# EAGLE schematic lap_counter_V1.2 (EAGLE 9.6.0)
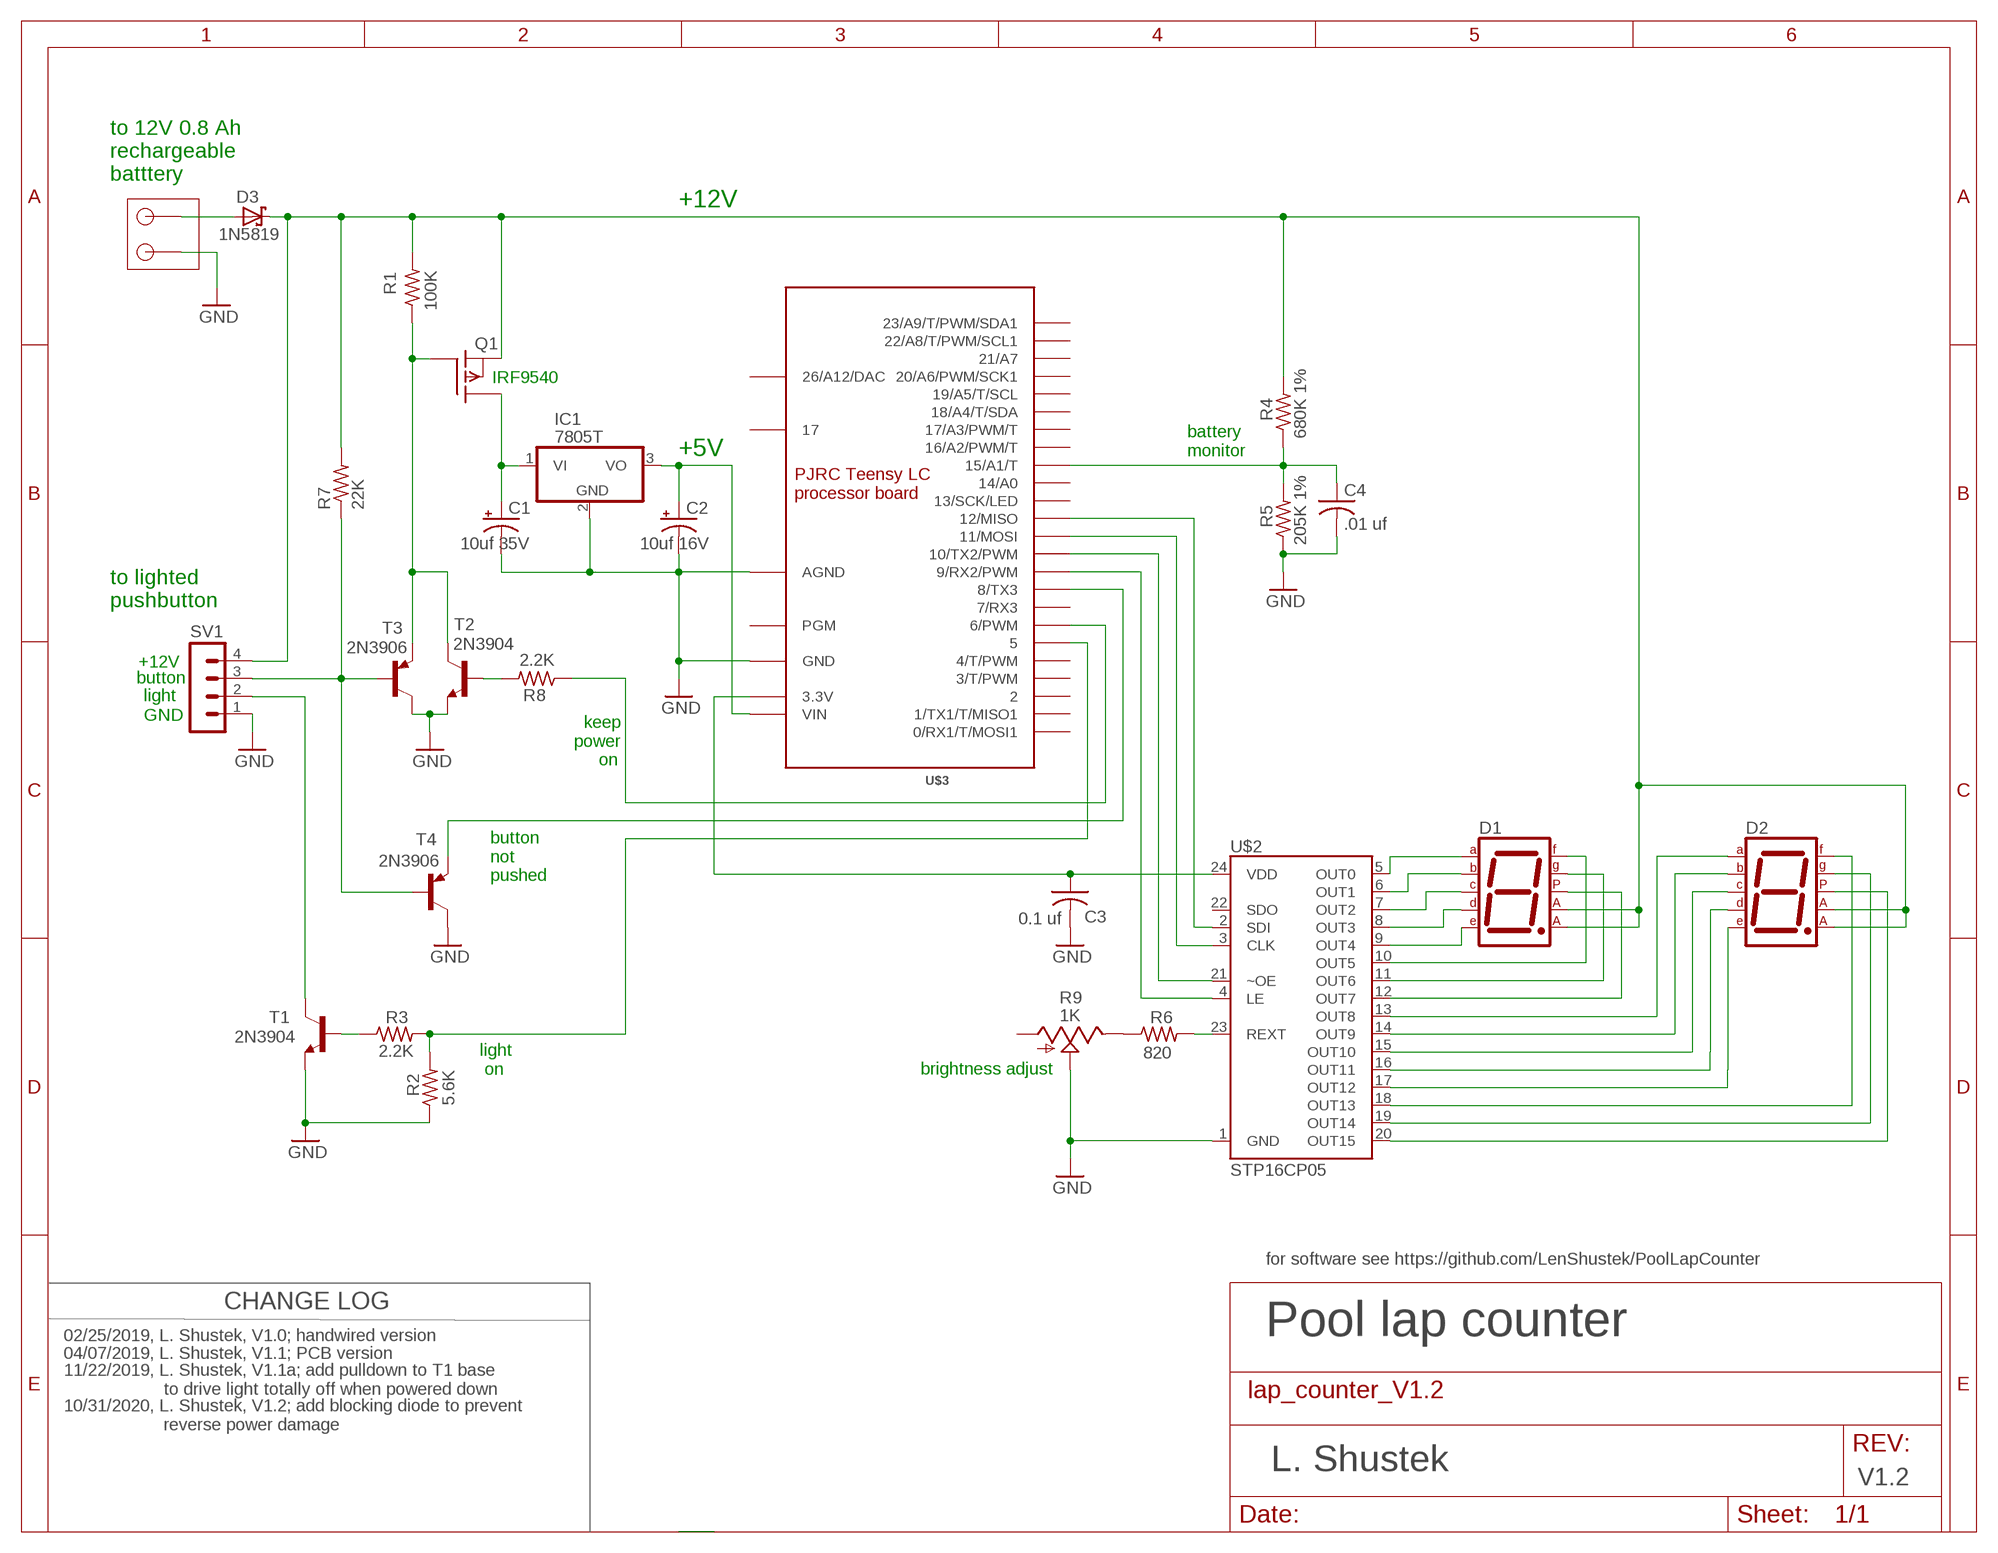
[diagram p0: schematic, sheet 1]

## Parts
C1  10uf 35V  CPOL-USE2.5-6  [E2,5-6]
C2  10uf 16V  CPOL-USE2.5-6  [E2,5-6]
C3  0.1 uf  C-US025-030X050  [C025-030X050]
C4  .01 uf  C-US025-030X050  [C025-030X050]
D1  7SEG-CA  [7SEG-13]
D2  7SEG-CA  [7SEG-13]
D3  1N5819  SCHOTTKY-DIODEDO41  [DO41-10]
IC1  7805T  [TO220H]
Q1  IRF9530  [TO220]
R1  100K  R-US_0207/10  [0207/10]
R2  5.6K  R-US_0207/10  [0207/10]
R3  2.2K  R-US_0207/10  [0207/10]
R4  680K 1%  R-US_0207/10  [0207/10]
R5  205K 1%  R-US_0207/10  [0207/10]
R6  820  R-US_0207/10  [0207/10]
R7  22K  R-US_0207/10  [0207/10]
R8  2.2K  R-US_0207/10  [0207/10]
R9  1K  TRIM_US-B25P  [B25P]
SV1  MA04-1  [MA04-1]
T1  2N3904  2N2222  [TO92-EBC-OVAL]
T2  2N3904  2N2222  [TO92-EBC-OVAL]
T3  2N3906  2N2907  [TO92-EBC-OVAL]
T4  2N3906  2N2907  [TO92-EBC-OVAL]
U$1  CONNECTOR-2PIN  [CONNECTOR-2PIN-5MM]
U$2  STP16CP05  [SO-24DW]
U$3  TEENSY_LC_OUTER_ROW  [TEENSY3-OUTER_ROW]

## Nets
GND [power]: C1.- C2.- C3.2 C4.2 IC1.2(GND) R2.1 R5.1 R9.S SV1.1 T1.E T2.E T3.C T4.C U$1.P$1 U$2.1(GND) U$3.AGND U$3.GND U$3.GND1(GND)
N$1 [power]: D1.3(CA1) D1.8(CA2) D2.3(CA1) D2.8(CA2) D3.C Q1.3(S) R1.2 R4.2 R7.2 SV1.4
N$2: C4.1 R4.1 R5.2 U$3.15/A1(15/A1/T)
N$3: Q1.1(G) R1.1 T2.C T3.E
N$4: C1.+ IC1.1(VI) Q1.2(D)
N$5 [power]: C2.+ IC1.3(VO) U$3.VIN
N$7: R3.1 T1.B
N$8: R6.1 R9.E
N$9: R6.2 U$2.23(REXT)
N$10: U$2.2(SDI) U$3.12(12/MISO)
N$11: U$2.3(CLK) U$3.11(11/MOSI)
N$12: U$2.21(~OE) U$3.10(10/TX2/PWM)
N$13: U$2.4(LE) U$3.9(9/RX2/PWM)
N$14: D1.7(A) U$2.5(OUT0)
N$15: D1.6(B) U$2.6(OUT1)
N$16: D1.4(C) U$2.7(OUT2)
N$17: D1.2(D) U$2.8(OUT3)
N$18: D1.1(E) U$2.9(OUT4)
N$19: D1.9(F) U$2.10(OUT5)
N$20: D1.10(G) U$2.11(OUT6)
N$21: D2.7(A) U$2.13(OUT8)
N$22: D2.6(B) U$2.14(OUT9)
N$23: D2.4(C) U$2.15(OUT10)
N$24: D2.2(D) U$2.16(OUT11)
N$25: D2.1(E) U$2.17(OUT12)
N$26: D2.9(F) U$2.18(OUT13)
N$27: D2.10(G) U$2.19(OUT14)
N$28: SV1.2 T1.C
N$29: R8.2 T2.B
N$30: R8.1 U$3.6(6/PWM)
N$31: R7.1 SV1.3 T3.B T4.B
N$32: D1.5(DP) U$2.12(OUT7)
N$33: R2.2 R3.2 U$3.5
N$34: T4.E U$3.8(8/TX3)
N$35 [power]: C3.1 U$2.24(VDD) U$3.3.3V U$3.3.3V1(3.3V)
N$36: D3.A U$1.P$2
N$40: D2.5(DP) U$2.20(OUT15)
Unconnected: R9.A U$2.22(SDO) U$3.0(0/RX1/T/MOSI1) U$3.1(1/TX1/T/MISO1) U$3.2 U$3.3(3/T/PWM) U$3.4(4/T/PWM) U$3.7(7/RX3) U$3.13(13/SCK/LED) U$3.14/A0 U$3.16/A2(16/A2/PWM/T) U$3.17/A3(17/A3/PWM/T) U$3.18/A4(18/A4/T/SDA) U$3.19/A5(19/A5/T/SCL) U$3.20/A6(20/A6/PWM/SCK1) U$3.21/A7 U$3.22/A8(22/A8/T/PWM/SCL1) U$3.23/A9(23/A9/T/PWM/SDA1) U$3.PGM U$3.VBAT

## Notes on the sheet
- to 12V 0.8 Ah
  rechargeable 
  batttery
- +12V
- IRF9540
- +5V
- battery
  monitor
- PJRC Teensy LC 
  processor board
- to lighted 
  pushbutton
- +12V
- button
- light
- GND
- keep
  power
       on
- button
  not
  pushed
- light
   on
- brightness adjust
- for software see https://github.com/LenShustek/PoolLapCounter
- CHANGE LOG
- Pool lap counter
- 02/25/2019, L. Shustek, V1.0; handwired version
- 04/07/2019, L. Shustek, V1.1; PCB version
- 11/22/2019, L. Shustek, V1.1a; add pulldown to T1 base 
                      to drive light totally off when powered down
- 10/31/2020, L. Shustek, V1.2; add blocking diode to prevent 
                      reverse power damage
- L. Shustek
- V1.2

## Power pins joined to a net without a drawn wire
26/A12/DAC: U$3.RESET/DAC(26/A12/DAC)

## Library data of the parts
C1 C2 = adafruit:CPOL-US: POLARIZED CAPACITOR, American symbol
C3 C4 = adafruit:C-US: CAPACITOR, American symbol
D1 D2 = Len:7SEG-CA: 7-segment DISPLAY single anode, 13 mm
D3 = adafruit:SCHOTTKY-DIODE: Schottky Diode
IC1 = linear:78*: Positive VOLTAGE REGULATOR Source: http://cache.national.com/ds/LM/LM78L05.pdf http://www.fairchildsemi.com/ds/LM/LM7805.pdf
Q1 = transistor-fet:IRF9530: P-Channel Enhancement MOSFET (HEXFET); -100V; -12A; 0,3Ohm
R1-R8 = resistor:R-US_: RESISTOR, American symbol
R9 = pot:TRIM_US-: POTENTIOMETER
SV1 = con-lstb:MA04-1: PIN HEADER; OC_FARNELL: unknown; OC_NEWARK: unknown
T1 T2 = adafruit:2N2222: NPN TRANSISTOR Big oval pads
T3 T4 = adafruit:2N2907*: PNP Transistor Big Oval pads
U$1 = Len:CONNECTOR-2PIN
U$2 = SparkFun-Retired:STP16CP05: 16-pin constant current sink shift register LED driver Not in catalog
U$3 = Teensy_3_and_LC_Series_Boards_v1.0:TEENSY_LC_OUTER_ROW: Teensy LC with only outer row of pins.

## Net classes
0 default: width 0.381 mm, clearance 0.254 mm
1 power: width 0.508 mm, clearance 0.254 mm to class 0, clearance 0.254 mm